# Altium schematic sheet Analog.SchDoc
size A3; Organization: ElektronikLabor; SheetNumber: 3; SheetName: Input & Voltage Sensing
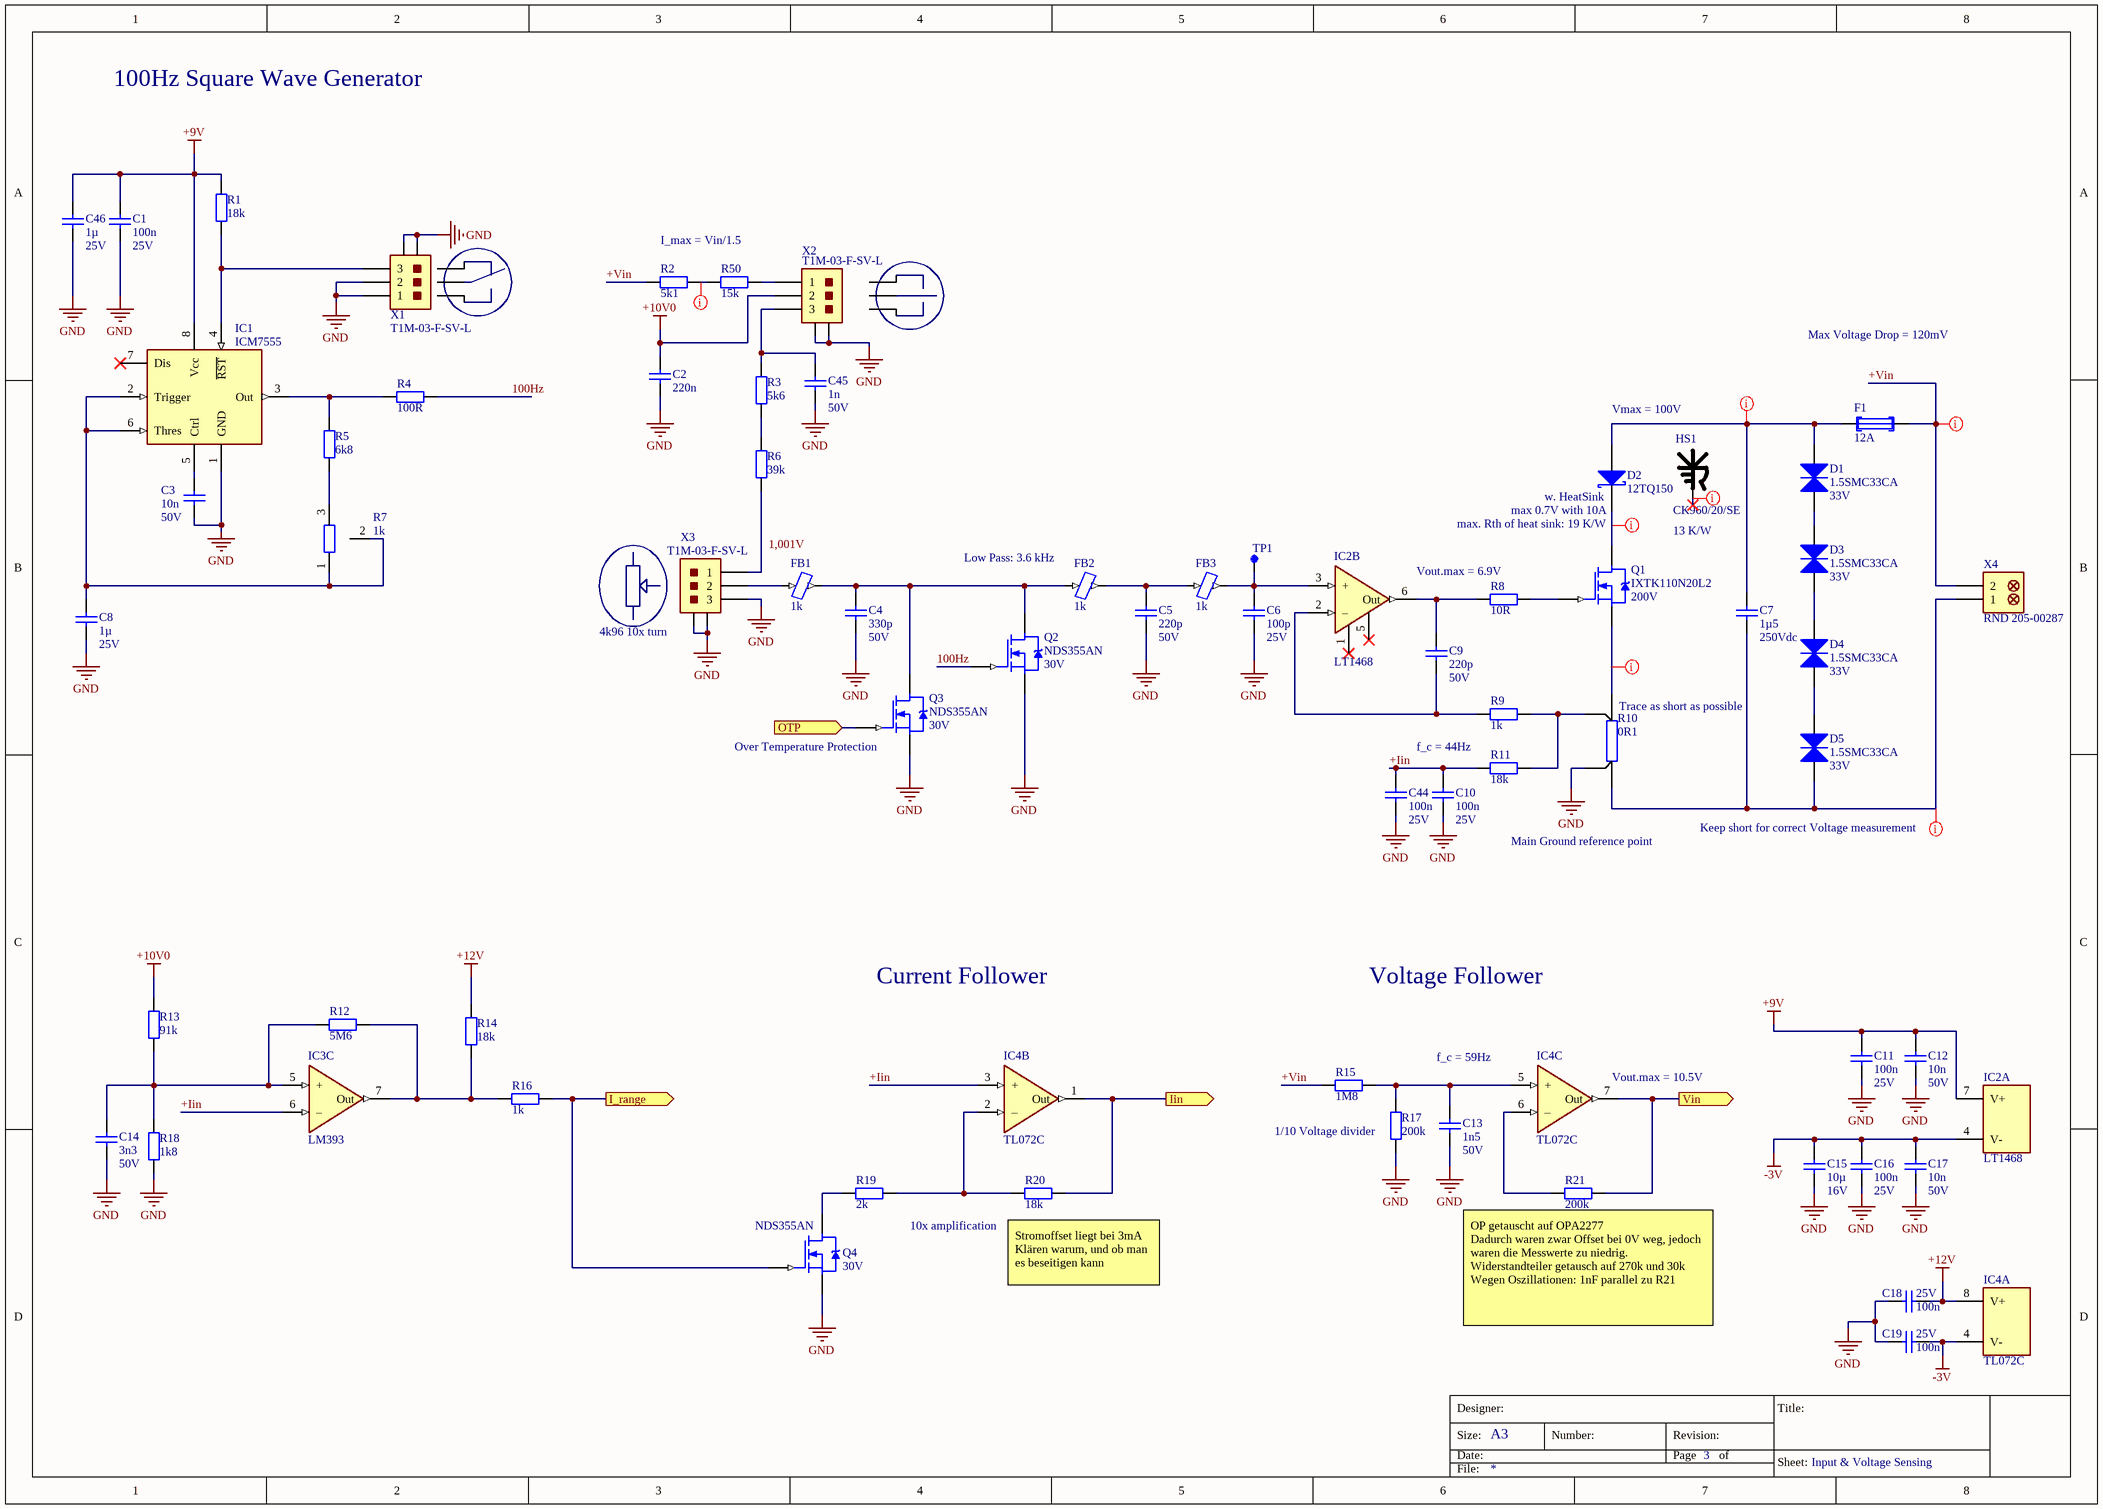
[diagram p0: Analog.SchDoc]

## Parts
C1  100n  Voltage: 25V  [C_0805]
C2  220n  [C_0805]
C3  10n  Voltage: 50V  [C_0805]
C4  330p  Voltage: 50V  [C_0805]
C5  220p  Voltage: 50V  [C_0805]
C6  100p  Voltage: 25V  [C_0805]
C7  1µ5  Voltage: 250Vdc  [Cap Film 15mm THT]
C8  1µ  Voltage: 25V  [C_0805]
C9  220p  Voltage: 50V  [C_0805]
C10  100n  Voltage: 25V  [C_0805]
C11  100n  Voltage: 25V  [C_0805]
C12  10n  Voltage: 50V  [C_0805]
C13  1n5  Voltage: 50V  [C_0805]
C14  3n3  Voltage: 50V  [C_0805]
C15  10µ  Voltage: 16V  [C_1206]
C16  100n  Voltage: 25V  [C_0805]
C17  10n  Voltage: 50V  [C_0805]
C18  100n  Voltage: 25V  [C_0805]
C19  100n  Voltage: 25V  [C_0805]
C44  100n  Voltage: 25V  [C_0805]
C45  1n  Voltage: 50V  [C_0805]
C46  1µ  Voltage: 25V  [C_0805]
D1  1.5SMC33CA  Voltage: 33V  [DO-214AB]
D2  12TQ150  [TO-220-2 Vertical]
D3  1.5SMC33CA  Voltage: 33V  [DO-214AB]
D4  1.5SMC33CA  Voltage: 33V  [DO-214AB]
D5  1.5SMC33CA  Voltage: 33V  [DO-214AB]
F1  12A  [Fuse w Holder 5x20mm 25mm]
FB1  1k  [Ferrite 0805]
FB2  1k  [Ferrite 0805]
FB3  1k  [Ferrite 0805]
HS1  CK960/20/SE  [Mech Heat Sink CK960/20/SE]
IC1  ICM7555  [SOIC8_N]
IC2  LT1468  [SOIC8_N]  (parts A,B of 2)
IC3  LM393  [SOIC8_N]  (part C of 3)
IC4  TL072C  [SOIC8_N]  (parts A,B,C of 3)
Q1  IXTK110N20L2  Voltage: 200V  [TO-264-3 vertical]
Q2  NDS355AN  Voltage: 30V  [SOT23_N - n-MOS]
Q3  NDS355AN  Voltage: 30V  [SOT23_N - n-MOS]
Q4  NDS355AN  Voltage: 30V  [SOT23_N - n-MOS]
R1  18k  [Res 0805]
R2  5k1  [Res 0805]
R3  5k6  [Res 0805]
R4  100R  [Res 0805]
R5  6k8  [Res 0805]
R6  39k  [Res 0805]
R7  1k  [Poti 3296Y]
R8  10R  [Res 0805]
R9  1k  [Res 0805]
R10  0R1  [Res 4-SIL]
R11  18k  [Res 0805]
R12  5M6  [Res 0805]
R13  91k  [Res 0805]
R14  18k  [Res 0805]
R15  1M8  [Res 0805]
R16  1k  [Res 0805]
R17  200k  [Res 0805]
R18  1k8  [Res 0805]
R19  2k  [Res 0805]
R20  18k  [Res 0805]
R21  200k  [Res 0805]
R50  15k  [Res 0805]
TP1  *  [Test Point SMD Rnd 1mm]  (value not drawn)  (no BOM)
X1  T1M-03-F-SV-L  [T1M-03-XX-S-V]
X2  T1M-03-F-SV-L  [T1M-03-XX-S-V]
X3  T1M-03-F-SV-L  [T1M-03-XX-S-V]
X4  RND 205-00287  [TRMNL 5.08mm 2x]

## Ports
I_range (out), Iin (out), OTP (in), Vin (out)

## Nets
+9V: C1.1 C11.1 C12.1 C46.1 IC1.8(Vcc) IC2.7(V+) R1.1
+10V0: C2.1 R13.1 X2.2
+12V: C18.2 IC4.8(V+) R14.1
-3V: C15.1 C16.1 C17.1 C19.1 IC2.4(V-) IC4.4(V-)
GND: C1.2 C2.2 C3.2 C4.2 C5.2 C6.2 C8.2 C10.2 C11.2 C12.2 C13.2 C14.2 C15.2 C16.2 C17.2 C18.1 C19.2 C44.2 C45.2 C46.2 IC1.1(GND) Q2.2(S) Q3.2(S) Q4.2(S) R10.3 R17.2 R18.2 X1.1 X1.2 X1.4(CASE) X1.5(CASE) X2.4(CASE) X2.5(CASE) X3.3 X3.4(CASE) X3.5(CASE)
100Hz: Q2.1(G) R4.2
+Iin: C10.1 C44.1 IC3.6(–) IC4.3(+) R11.1
+Vin: F1.2 R2.1 R15.1 X4.2
I_range: Q4.1(G) R16.2 ; port I_range
Iin: IC4.1(Out) R20.2 ; port Iin
OTP: Q3.1(G) ; port OTP
Vin: IC4.7(Out) R21.2 ; port Vin
NetC3_1: C3.1 IC1.5(Ctrl)
NetC4_1: C4.1 FB1.2 FB2.1 Q2.3(D) Q3.3(D)
NetC5_1: C5.1 FB2.2 FB3.1
NetC6_1: C6.1 FB3.2 IC2.3(+) TP1.1
NetC7_1: C7.1 D1.1 D2.2(A) F1.1
NetC7_2: C7.2 D5.2 R10.4 X4.1
NetC8_1: C8.1 IC1.2(Trigger) IC1.6(Thres) R7.1 R7.2
NetC9_1: C9.1 IC2.6(Out) R8.1
NetC9_2: C9.2 IC2.2(–) R9.1
NetC13_1: C13.1 IC4.5(+) R15.2 R17.1
NetC14_1: C14.1 IC3.5(+) R12.1 R13.2 R18.1
NetC45_1: C45.1 R3.1 X2.3
NetD1_2: D1.2 D3.1
NetD2_1: D2.1(K) Q1.2(D)
NetD3_2: D3.2 D4.1
NetD4_2: D4.2 D5.1
NetFB1_1: FB1.1 X3.2
NetIC1_3: IC1.3(Out) R4.1 R5.1
NetIC1_4: IC1.4(~{RST}) R1.2 X1.3
NetIC3_7: IC3.7(Out) R12.2 R14.2 R16.1
NetIC4_2: IC4.2(–) R19.2 R20.1
NetIC4_6: IC4.6(–) R21.1
NetQ1_1: Q1.1(G) R8.2
NetQ1_3: Q1.3(S) R10.1
NetQ4_3: Q4.3(D) R19.1
NetR2_2: R2.2 R50.1
NetR3_2: R3.2 R6.1
NetR5_2: R5.2 R7.3
NetR6_2: R6.2 X3.1
NetR9_2: R9.2 R10.2 R11.2
NetR50_2: R50.2 X2.1

Not connected (* = marked no-connect by the designer): HS1 1*; IC1 7(Dis)*; IC2 1(NULL)* 5(NULL)* 8(DNC)

## Layout directives
rule Width Constraint [Pref Width = 5mm    Min Width = 1mm    Max Width = 6mm]; rule Clearance Constraint [Clearance = 0.5mm]; rule Power Plane Clearance [Clearance = 0.5mm]: NetC7_2
rule Width Constraint [Pref Width = 5mm    Min Width = 0.5mm    Max Width = 6mm]; rule Clearance Constraint [Generic clearance = 1.2mm, and 1 value(s) for objects]; rule Power Plane Clearance [Clearance = 1mm]: +Vin
rule Width Constraint [Pref Width = 5mm    Min Width = 3mm    Max Width = 6mm]; rule Clearance Constraint [Clearance = 0.5mm]: NetQ1_3
rule Width Constraint [Pref Width = 196.85mil    Min Width = 118.11mil    Max Width = 236.22mil]; rule Clearance Constraint [Clearance = 0.75mm]: NetD2_1
rule Width Constraint [Pref Width = 5mm    Min Width = 1mm    Max Width = 6mm]; rule Clearance Constraint [Clearance = 0.75mm]: NetC7_1
rule Clearance Constraint [Clearance = 0.75mm]; rule Component Clearance Constraint [Horizontal Clearance = 0mm    Vertical Clearance = 0mm]: NetHS1_1
rule Clearance Constraint [Clearance = 0.5mm]: NetR2_2

## Notes on the sheet
- 100Hz Square Wave Generator
- I_max = Vin/1.5
- Max Voltage Drop = 120mV
- Vmax = 100V
- (near D2) max 0.7V with 10A
- (near D2) w. HeatSink
- 1,001V
- (near FB2) Low Pass: 3.6 kHz
- Vout.max = 6.9V
- max. Rth of heat sink: 19 K/W
- (near HS1) 13 K/W
- (near X3) 4k96 10x turn
- (near R10) Trace as short as possible
- (near Q3) Over Temperature Protection
- f_c = 44Hz
- Main Ground reference point
- Keep short for correct Voltage measurement
- Current Follower
- Voltage Follower
- f_c = 59Hz
- (near IC4) Vout.max = 10.5V
- (near R17) 1/10 Voltage divider
- 10x amplification
- (near R20) Stromoffset liegt bei 3mA
  Klären warum, und ob man es beseitigen kann
- (near R21) OP getauscht auf OPA2277
  Dadurch waren zwar Offset bei 0V weg, jedoch waren die Messwerte zu niedrig.
  Widerstandteiler getausch auf 270k und 30k
  Wegen Oszillationen: 1nF parallel zu R21
- Size:
- Date:
- Designer:
- A3
- Number:
- Revision:
- Page
- of
- Title:
- File:
- Sheet:

## Library data of the parts
C1 C10 C11 C16 C18 C19 C44 = C-Cer 0805 100n: Cap Ceramic 0805 100n 25V; Manufacturer: generic; Temp. Coeff.: X7R; PackageReference: C_0805; PackageDescription: Chip Capacitor; Value: 100n; PartNumber: generic
C2 = C-Cer 0805 220n: Cap Ceramic 0805 220n 50V; Manufacturer: generic; Temp. Coeff.: X7R; PackageReference: C0805; PackageDescription: Chip Capacitor; Value: 220n; PartNumber: generic; Voltage: 50V
C3 C12 C17 = C-Cer 0805 10n: Cap Ceramic 0805 10n 50V; Manufacturer: generic; Temp. Coeff.: X7R; PackageReference: C0805; PackageDescription: Chip Capacitor; Value: 10n; PartNumber: generic
C4 = C-Cer 0805 330p: Cap Ceramic 0805 330p 50V; Manufacturer: generic; Temp. Coeff.: X7R; PackageReference: C0805; PackageDescription: Chip Capacitor; Value: 330p; PartNumber: generic; Price [€]: 0,18
C5 C9 = C-Cer 0805 220p: Cap Ceramic 0805 220p 50V; Manufacturer: generic; Temp. Coeff.: X7R; PackageReference: C0805; PackageDescription: Chip Capacitor; Value: 220p; PartNumber: generic
C6 = C-Cer 0805 100p: Cap Ceramic 0805 100p 50V; Manufacturer: generic; Temp. Coeff.: C0G; PackageReference: C0805; PackageDescription: Chip Capacitor; Value: 100p; PartNumber: generic
C7 = Cap-Film 1µ5 250V 15mm: Cap Film 1µ5 250V 15mm; Manufacturer: Panasonic; PartNumber: ECQE2155KF; Other: Available; Value: 1µ5
C8 C46 = C-Cer 0805 1µ: Cap Ceramic 0805 1µ 25V; Manufacturer: Samsung; PartNumber: CL21B105KAFNNNE; Temp. Coeff.: X7R; Tolerance: 10%; PackageReference: C0805; PackageDescription: Chip Capacitor; Value: 1µ; Supplier 1: Digi-Key; Supplier Part Number 1: 1276-1066-1-ND
C13 = C-Cer 0805 1n5: Cap Ceramic 0805 1n5 50V; Manufacturer: generic; Temp. Coeff.: X7R; PackageReference: C0805; PackageDescription: Chip Capacitor; Value: 1n5; PartNumber: generic
C14 = C-Cer 0805 3n3: Cap Ceramic 0805 3n3 50V; Manufacturer: generic; Temp. Coeff.: X7R; PackageReference: C0805; PackageDescription: Chip Capacitor; Value: 3n3; PartNumber: generic
C15 = C-Cer 1206 16V 10µ: Cap Ceramic 1206 10µ 16V; PartNumber: CL31B106MOHNNNE; Manufacturer: Samsung; Temp. Coeff.: X7R; PackageReference: C1206; PackageDescription: Chip Capacitor; Value: 10µ; Supplier 1: Digi-Key; Supplier Part Number 1: 1276-6641-1-ND; Price [€]: 0,13
C45 = C-Cer 0805 1n: Cap Ceramic 0805 1n 50V; Manufacturer: generic; Temp. Coeff.: X7R; PackageReference: C0805; PackageDescription: Chip Capacitor; Value: 1n; PartNumber: generic
D1 D3-D5 = Diode 1.5SMC33CA: Diode, TVS, Bi, 33V, 33A, DO-214AB; Manufacturer: Littelfuse; Current: 33.3A; Notes: Available; Max. Voltage: 45.7V; ComponentLink1Description: Datasheet; ComponentLink1URL: G:\Daten\Datenblätter\Dioden\1_5SMC_TVS.pdf; PartNumber: 1.5SMC33CA; Value: 1.5SMC33CA
D2 = Diode Schottky 15A: Diode Schottky, 150V, 15A, TO-220-2; Manufacturer: SMC; PartNumber: 12TQ150; ComponentLink1Description: Datasheet; ComponentLink1URL: G:\Daten\Datenblätter\Dioden\12TQ150.pdf; Voltage: 150V; Current: 15A; Value: 12TQ150; Supplier 1: Digi-Key; Supplier Part Number 1: 1655-1002-ND; Price [€]: 0,61
F1 = Fuse w Holder 0031.8211 12A: Fuse w Holder 5x20mm 25mm 12A THT; Manufacturer: Schurter; Other: Sicherung: MTR. 10A; PartNumber: 0031.8211; Current: 12A; ComponentLink1URL: G:\Daten\Datenblätter\Sicherungen\Halter_15x20mm_Schurter_0031.82x1.pdf; ComponentLink1Description: Datasheet; Value: 12A; Size of Fuse: 5x20mm; ComponentLink2Description: Supplier; Supplier 1: Reichelt; Supplier Part Number 1: PL OGN-25; Price [€]: 0,44; ComponentLink2URL: https://www.reichelt.de/Sicherungshalter/PL-OGN-25/3/index.html?ACTION=3&GROUPID=7659&ARTICLE=35196&OFFSET=100&
FB1-FB3 = Ferrite Bead BLM21AG102SN1: Ferrite Bead 0805 1k 100MHz; Manufacturer: Murata; Current: 500mA; PartNumber: BLM21AG102SN1; Value: 1k; Frequency: 100MHz; ComponentLink1Description: Datasheet; ComponentLink1URL: G:\Daten\Datenblätter\Ferrite\BLM21AG102SN1.pdf; Supplier Part Number 1: BLM21AG 102; Supplier 1: Reichelt; ComponentLink2URL: https://www.reichelt.de/Filter/BLM21AG-102/3/index.html?ACTION=3&GROUPID=3175&ARTICLE=89684&OFFSET=75&; ComponentLink2Description: Supplier
HS1 = Mech Heat Sink CK960/20/SE: Mech Heat Sink CK960/20/SE TO-220; Unfertig; Manufacturer: Alutronic; Temp. Coeff.: 13 K/W; PartNumber: CK960/20/SE; DImensions: 20x20 mm; ComponentLink1Description: Datasheet; ComponentLink1URL: G:\Daten\Datenblätter\Kühlkörper\CK960-20-SE.pdf; Supplier Part Number 1: V CK960/20; Supplier 1: Reichelt
IC1 = Timer ICM7555IBA: Timer ICM7555 8-SOIC; Manufacturer: Intersil; PartNumber: ICM7555IBA; ComponentLink1Description: Datasheet; ComponentLink1URL: G:\Daten\Datenblätter\Timer\ICM755IBA.pdf; Value: ICM7555; Supplier Part Number 1: ICM 7555 IBAZ; Supplier 1: Reichelt
IC2 = LT1468: OpAmp LT1468 1x 90MHz; Manufacturer: Linear Technology; PartNumber: LT1468CS8; Value: LT1468; Price [€]: 7,05; ComponentLink1Description: Datasheet; ComponentLink1URL: G:\Daten\Datenblätter\Operationsverstärker\LT1468.pdf; Supplier 1: Reichelt; Supplier Part Number 1: LT 1468 CS8
IC3 = LM393DT: Comparator LM393DT 2x; Manufacturer: ST; Manufacturer_B: ROHM; Value: LM393; PartNumber: LM393DT; Price [€]: 0,44; ComponentLink1Description: Datasheet; ComponentLink1URL: G:\Daten\Datenblätter\Komparatoren\ST_LM393.pdf; Supplier 1: Digi-Key; Supplier Part Number 1: 497-1593-1-ND; PartNumber_B: LM393DT
IC4 = TL072C: OpAmp TL072CD 2x JFET 3MHz; Manufacturer: Texas Instruments; Notes: Available; Value: TL072C; PartNumber: TL072CD; ComponentLink1Description: Datasheet; ComponentLink1URL: G:\Daten\Datenblätter\Operationsverstärker\TL072C.pdf
Q1 = Transistor n-MOS IXTK110N20L2: Transistor n-MOS, TO-264, 200V, THT; Manufacturer: IXYS; Note: Vgs_max = 20V; Current: 110A; PackageDescription: TO-264; ComponentLink1Description: Datasheet; ComponentLink1URL: G:\Daten\Datenblätter\Transistoren\nMOS_IXTK110N20L2.pdf; PartNumber: IXTK110N20L2; Value: IXTK110N20L2; Supplier 1: Digi-Key; Supplier Part Number 1: IXTK110N20L2-ND; Price [€]: 24,00
Q2-Q4 = Transistor n-MOS NDS355AN: Transistor n-MOS SOT-23 30V Vgs=20V; Manufacturer: ON Semiconductor; Note: Vgs_max = 20V; Current: 1.7A; PackageDescription: SOT-23; ComponentLink1Description: Datasheet; ComponentLink1URL: G:\Daten\Datenblätter\Transistoren\nMOS_NDS355AN.pdf; PartNumber: NDS355AN; Supplier 1: Digi-Key; Supplier Part Number 1: NDS355ANCT-ND; Price [€]: 0,39
R1 R11 R14 R20 = Res 0805 18k: Resistor 0805 18k; Manufacturer: generic; Power: 0.125W; PartNumber: generic; Value: 18k
R2 = Res 0805 5k1: Resistor 0805 5k1; Manufacturer: generic; Power: 0.125W; PartNumber: generic; Value: 5k1
R3 = Res 0805 5k6: Resistor 0805 5k6; Manufacturer: generic; Power: 0.125W; PartNumber: generic; Value: 5k6
R4 = Res 0805 100R: Resistor 0805 100R; Manufacturer: generic; Power: 0.125W; PartNumber: generic; Value: 100R
R5 = Res 0805 6k8: Resistor 0805 6k8; Manufacturer: generic; Power: 0.125W; PartNumber: generic; Value: 6k8
R6 = Res 0805 39k: Resistor 0805 39k; Manufacturer: generic; Power: 0.125W; PartNumber: generic; Value: 39k
R7 = Pot 1k THT: Pot 1k THT 30 turns; Manufacturer: Suntan; PartNumber: TSR-3296-Y-102-R; Note: Available; Value: 1k; ComponentLink1Description: Datasheet; ComponentLink1URL: G:\Daten\Datenblätter\Potentiometer\TSR-3296.pdf
R8 = Res 0805 10R: Resistor 0805 10R; Manufacturer: generic; Power: 0.125W; Tolerance: 1%; PartNumber: generic; Value: 10R
R9 R16 = Res 0805 1k: Resistor 0805 1k; Manufacturer: generic; Power: 0.125W; PartNumber: generic; Value: 1k
R10 = Res 4-SIL 0R1: Resistor 4-SIL 0R1 0.5% 40W; Manufacturer: Riedon; PartNumber: PCS-0R1D1; Power: 40W; Value: 0R1; ComponentLink1URL: G:\Daten\Datenblätter\Widerstände\Riedon_PCS-PBV.pdf; ComponentLink1Description: Datasheet; Supplier 1: Digi-Key; Supplier Part Number 1: 696-1749-ND; Price [€]: 15,91; Tolerance: 0.5%
R12 = Res 0805 5M6: Resistor 0805 5M6; Manufacturer: generic; Power: 0.125W; PartNumber: generic; Value: 5M6
R13 = Res 0805 91k: Resistor 0805 91k; Manufacturer: generic; Power: 0.125W; PartNumber: generic; Value: 91k
R15 = Res 0805 1M8: Resistor 0805 1M8; Manufacturer: generic; Power: 0.125W; Voltage: 150V; PartNumber: generic; Value: 1M8
R17 R21 = Res 0805 200k: Resistor 0805 200k; Manufacturer: generic; Power: 0.125W; Voltage: 150V; PartNumber: generic; Value: 200k
R18 = Res 0805 1k8: Resistor 0805 1k8; Manufacturer: generic; Power: 0.125W; PartNumber: generic; Value: 1k8
R19 = Res 0805 2k: Resistor 0805 2k; Manufacturer: generic; Power: 0.125W; PartNumber: generic; Value: 2k
R50 = Res 0805 15k: Resistor 0805 15k; Manufacturer: generic; Power: 0.125W; PartNumber: generic; Value: 15k
TP1 = Test Point: SilkScreen: *
X1-X3 = Con Male 3-Pin: Connector, Male, Vertical, 3-Pin, 1mm, SMD; Manufacturer: SAMTEC; MatingPartNumber: S1SS-03-L; PartNumber: T1M-03-F-SV-L; Value: T1M-03-F-SV-L; Supplier Part Number 1: T1M-03-F-SV-L; Supplier 1: SAMTEC; ComponentLink1Description: Datasheet; ComponentLink1URL: G:\Daten\Datenblätter\Steckverbinder\T1M-Single-Row.pdf
X4 = Termial 2pin 5.08mm: Terminal, 2-Pin, 5.08mm, THT; Manufacturer: RND connect; Current: 20A; ComponentLink1Description: Reichelt URL; ComponentLink1URL: https://www.reichelt.de/RND-connect/RND-205-00287/3/index.html?ACTION=3&GROUPID=7552&ARTICLE=170288&OFFSET=16&; PartNumber: RND 205-00287; ComponentLink2Description: Datasheet; ComponentLink2URL: G:\Daten\Datenblätter\Verbinder\Terminal_RND_205-00287.pdf; Price [€]: 0,41; Supplier 1: Reichelt; Supplier Part Number 1: RND 205-00287